# EAGLE design oscillateur (EAGLE 9.3.0)
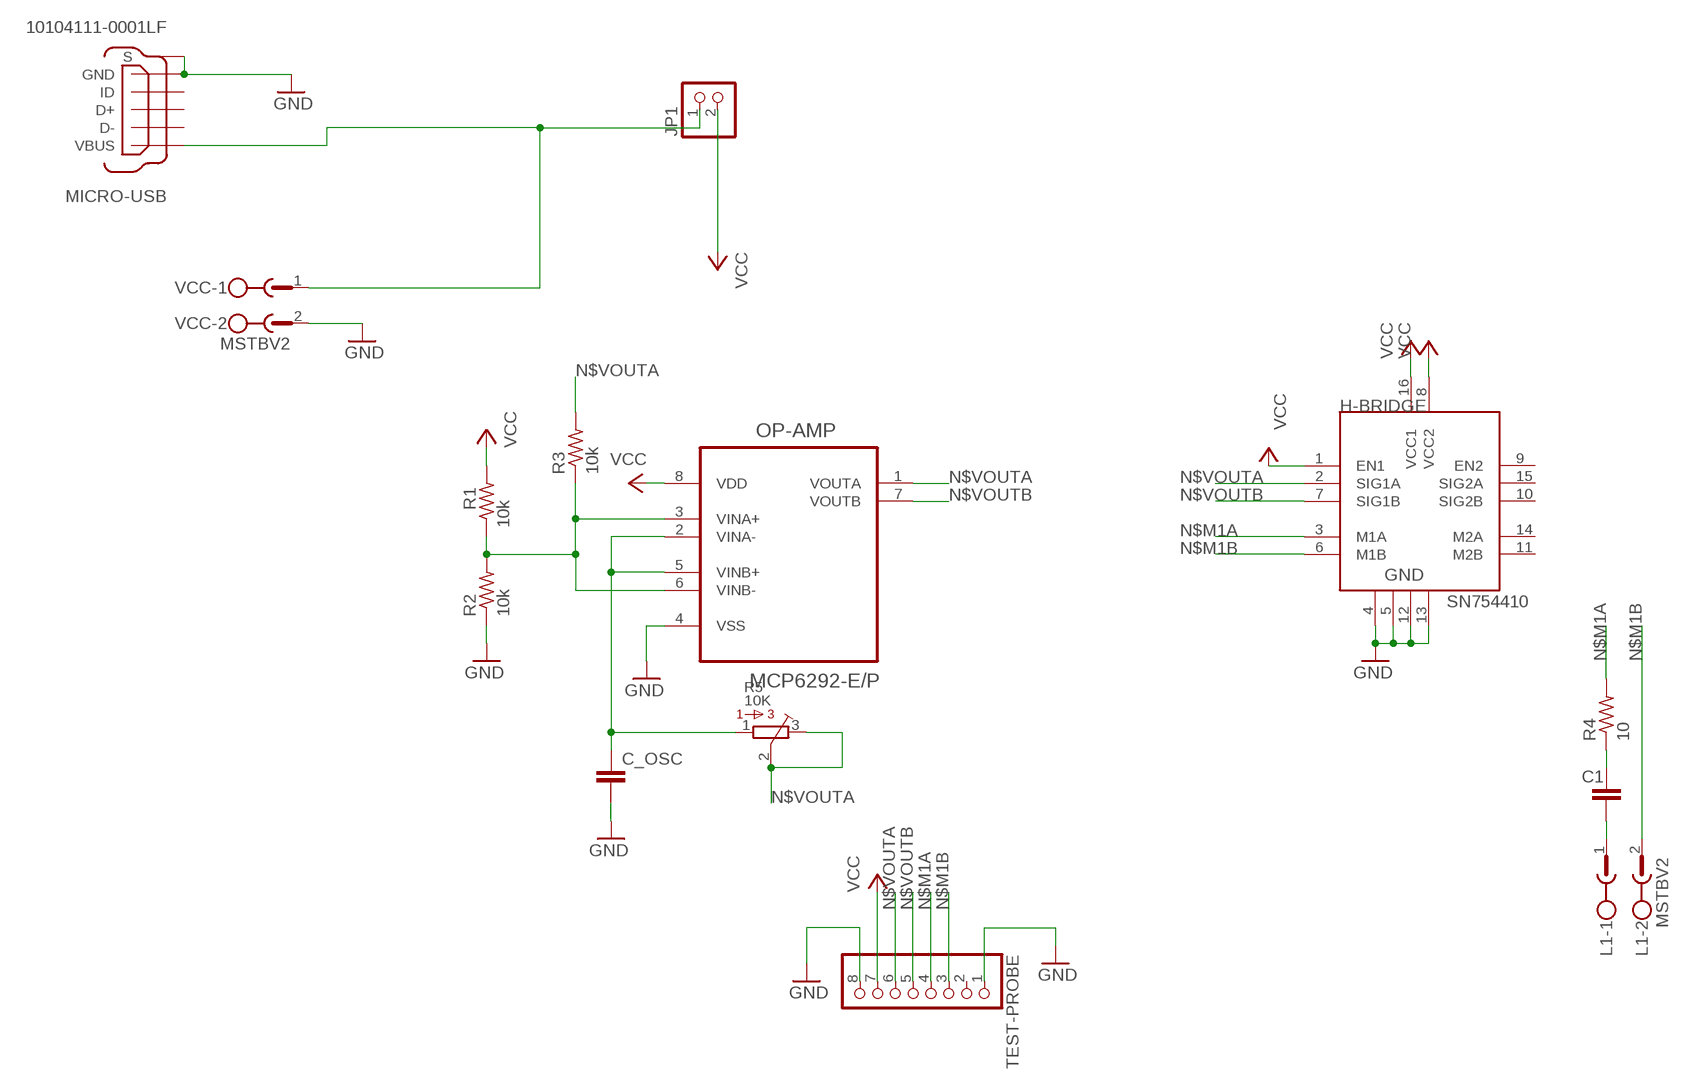
[diagram p0: schematic, sheet 1]

## Parts
C1  C5/2.5  [C5B2.5]
C_OSC  C5/2.5  [C5B2.5]
H-BRIDGE  SN754410  [DIP16]
JP1  PINHD-1X2  [1X02]
L1  MSTBV2  [MSTBV2]
MICRO-USB  10104111-0001LF  [FRAMATOME_10104111-0001LF]
OP-AMP  MCP6292-E/P  [DIP254P762X432-8]
R1  10k  R-US_0207/10  [0207/10]
R2  10k  R-US_0207/10  [0207/10]
R3  10k  R-US_0207/10  [0207/10]
R4  10  R-US_0207/10  [0207/10]
R5  10K  3362R  [3362R]
TEST-PROBE  PINHD-1X8  [1X08]
VCC  MSTBV2  [MSTBV2]

## Nets
GND [supply]: C_OSC.2 H-BRIDGE.4 H-BRIDGE.5 H-BRIDGE.12 H-BRIDGE.13 MICRO-USB.5(GND) MICRO-USB.6(S) MICRO-USB.7(S) MICRO-USB.8(S) MICRO-USB.9(S) OP-AMP.4(VSS) R2.1 TEST-PROBE.1 TEST-PROBE.8 VCC.2
N$1: OP-AMP.3(VINA+) OP-AMP.6(VINB-) R1.1 R2.2 R3.1
N$2 [supply]: JP1.1 MICRO-USB.1(VBUS) VCC.1
N$4 [supply]: C1.1 R4.1
N$6: C_OSC.1 OP-AMP.2(VINA-) OP-AMP.5(VINB+) R5.1
N$7 [supply]: C1.2 L1.1
N$M1A [supply]: H-BRIDGE.3(M1A) R4.2 TEST-PROBE.4
N$M1B [supply]: H-BRIDGE.6(M1B) L1.2 TEST-PROBE.3
N$VOUTA: H-BRIDGE.2(SIG1A) OP-AMP.1(VOUTA) R3.2 R5.2 R5.3 TEST-PROBE.6
N$VOUTB: H-BRIDGE.7(SIG1B) OP-AMP.7(VOUTB) TEST-PROBE.5
VCC [supply]: H-BRIDGE.1(EN1) H-BRIDGE.8(VCC2) H-BRIDGE.16(VCC1) JP1.2 OP-AMP.8(VDD) R1.2 TEST-PROBE.7
Unconnected: H-BRIDGE.9(EN2) H-BRIDGE.10(SIG2B) H-BRIDGE.11(M2B) H-BRIDGE.14(M2A) H-BRIDGE.15(SIG2A) MICRO-USB.2(D-) MICRO-USB.3(D+) MICRO-USB.4(ID) TEST-PROBE.2

## Library data of the parts
C1 C_OSC = capacitor-wima:C: CAPACITOR naming: grid - package width
H-BRIDGE = HBridge:SN754410: Quadruple half-H driver
JP1 = pinhead:PINHD-1X2: PIN HEADER
L1 VCC = con-phoenix-508:MSTBV2: PHOENIX; MPN: MSTBV 2,5/2-GF-5.08; OC_FARNELL: 1792792; OC_NEWARK: 69R9845
MICRO-USB = 10104111-0001LF:10104111-0001LF: Conn USB Type A/B RCP 5 POS 0.65mm Solder RA SMD 5 Terminal 1 Port T/R; AVAILABILITY: Unavailable; DESCRIPTION: Micro Usb, 2.0 Type Ab, Receptacle, Th; MF: Amphenol ICC; MP: 10104111-0001LF; PACKAGE: None; PRICE: None
OP-AMP = MCP6292-E_P:MCP6292-E/P: Rail-to-Rail Op Amp; AVAILABILITY: Unavailable; DESCRIPTION: Operational amplifier; 10MHz; 2.4÷5.5VDC; Channels: 2; DIP8; MF: Microchip; MP: MCP6292-E/P; PACKAGE: DIP-8 Microchip; PRICE: None
R1-R4 = rcl:R-US_: RESISTOR, American symbol; SPICEPREFIX: R
R5 = bourns:3362: 3362 Series 1/4" Square Trimmer
TEST-PROBE = pinhead:PINHD-1X8: PIN HEADER

## Net classes
1 supply: width 0.457 mm

## Board
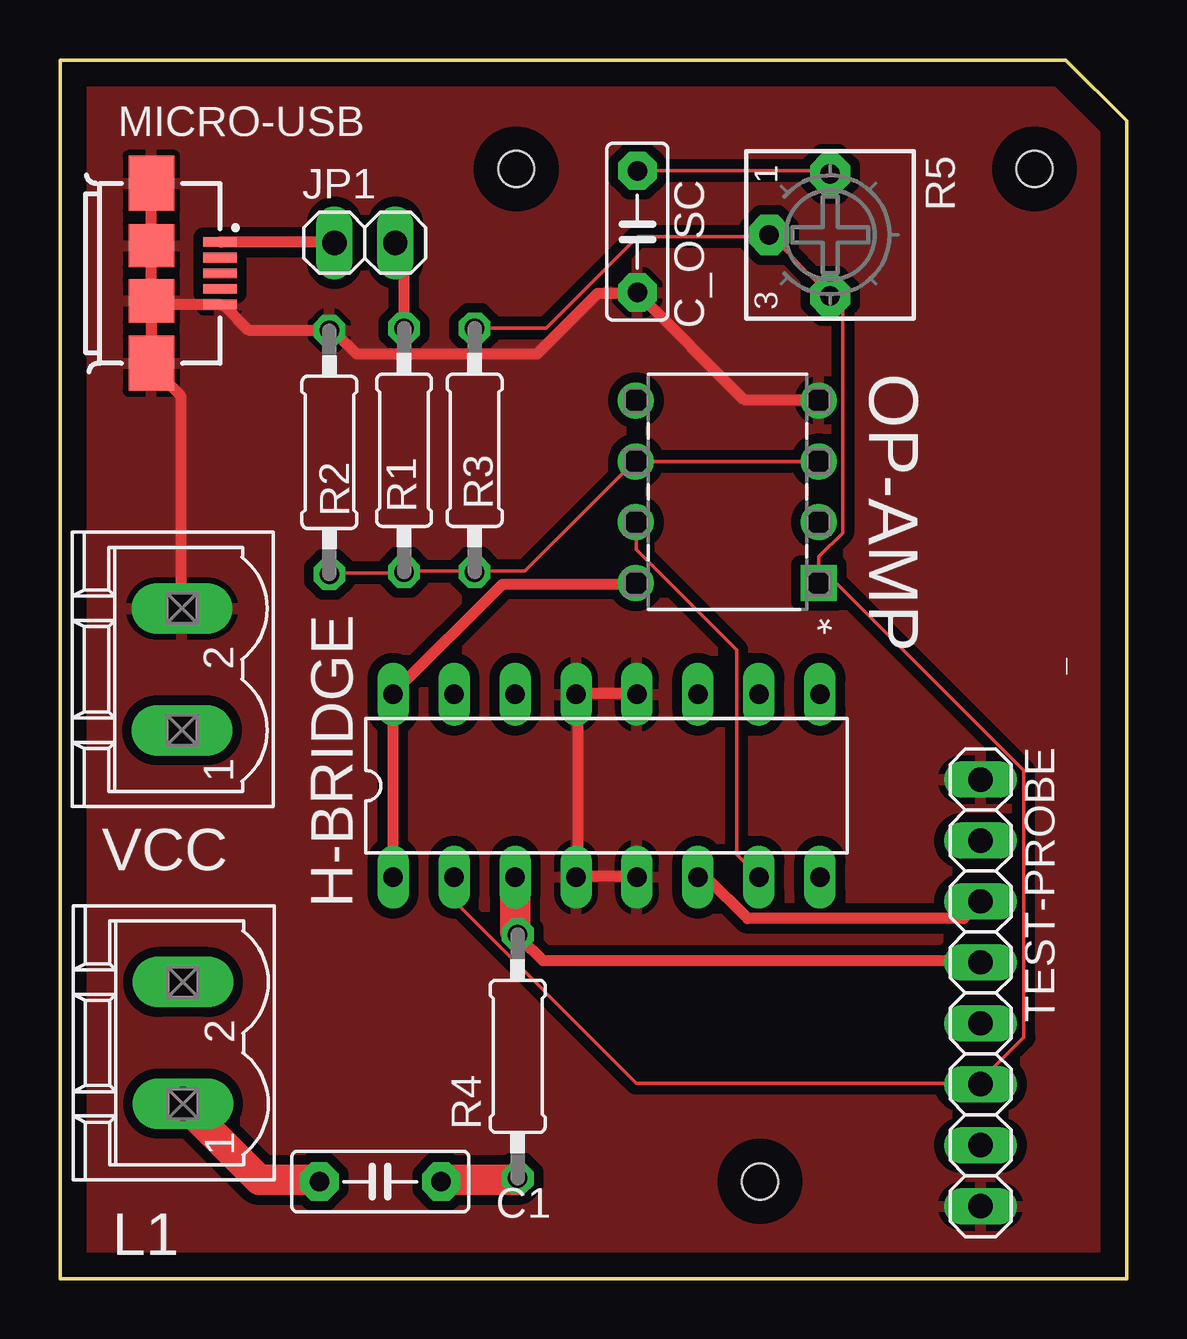
[diagram p1: board, top side]
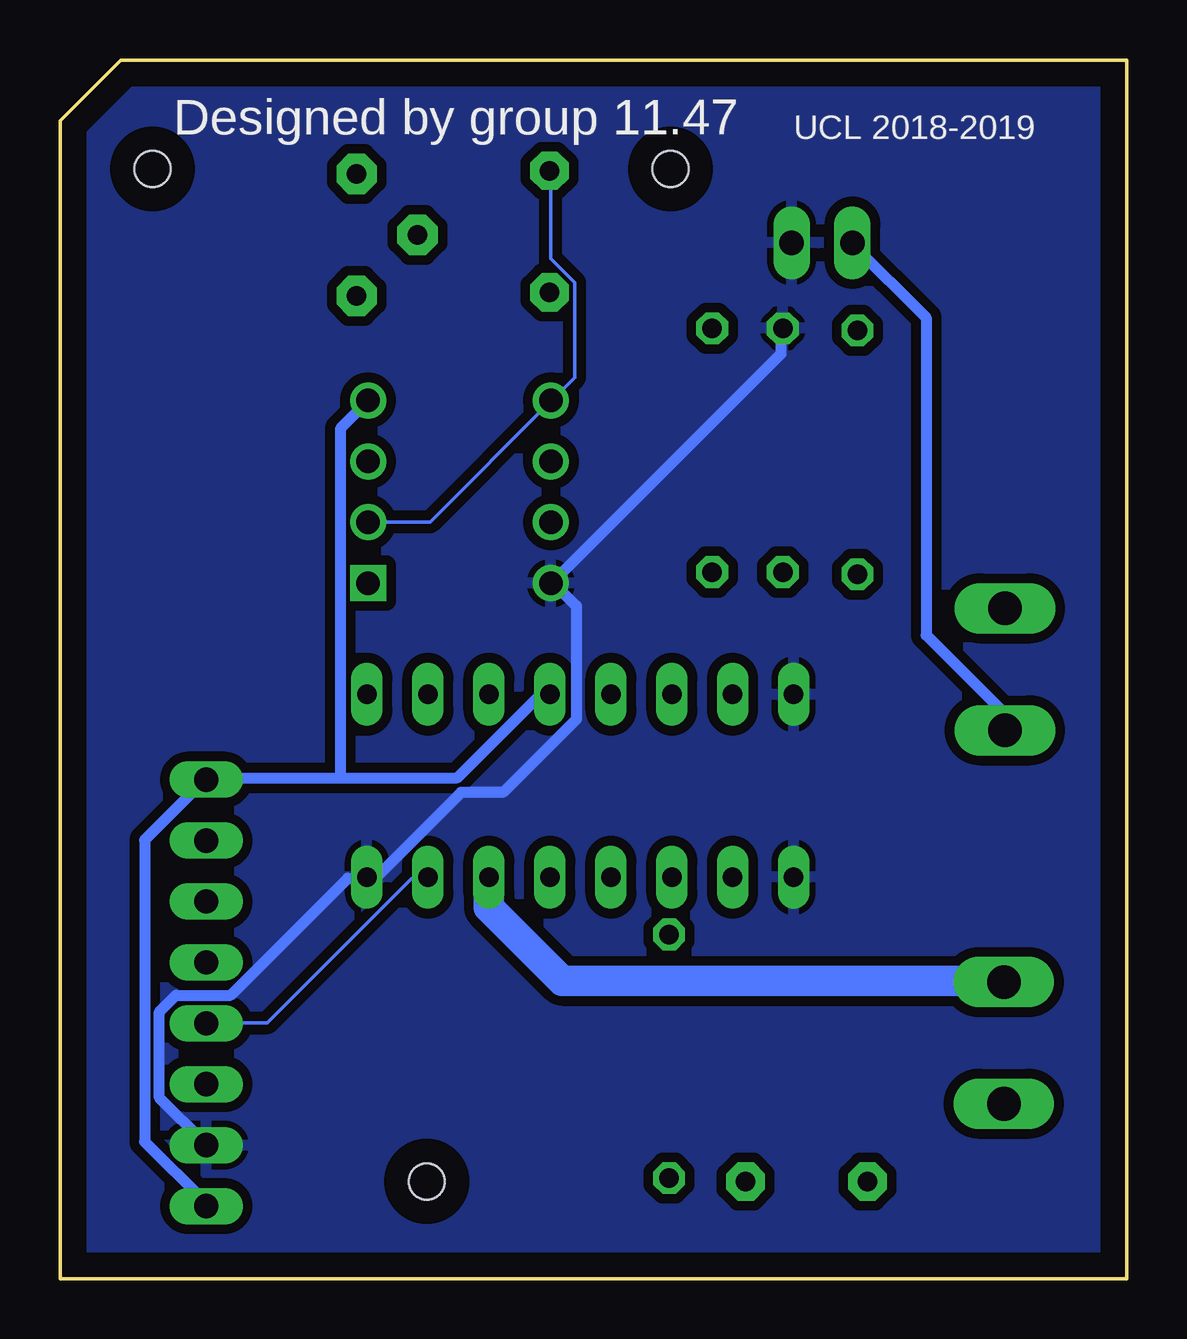
[diagram p2: board, bottom side, seen from below]

Size 44.45 x 50.8 mm. Coordinates in mm from the lower left corner, seen from the top.
Outline: 0,50.8 0,0 44.45,0 44.45,48.26 41.91,50.8 0,50.8
Copper layers (1*16): Top 0.035mm / dielectric 1.5mm / Bottom 0.035mm
Design rules "default": minimum track width 6mil, minimum drill 0.35mm, track to track 6mil, track to pad 6mil, pad to pad 6mil, via to via 6mil, smd to smd 6mil, copper to edge 40mil, drill to drill 6mil, minimum pad ring 10mil, minimum via ring 8mil, stop-mask expansion 4mil, vias tented up to drill 0mil, thermal gap 10mil
Holes 1.5 mm at 19.01,46.26 29.17,4.05 40.6,46.26

### Footprints (pad centres in the part's own frame; a part is rotated, then mirrored left to right if it is on the bottom)
C5B2.5 = drill 0.813 pad 1.6 octagon: 1 -2.54,0; 2 2.54,0
DIP16 = drill 0.813 long: 1 -10.16,-3.81; 2 -7.62,-3.81; 3 -5.08,-3.81; 4 -2.54,-3.81; 5 0,-3.81; 6 2.54,-3.81; 7 5.08,-3.81; 8 7.62,-3.81; 9 7.62,3.81; 10 5.08,3.81; 11 2.54,3.81; 12 0,3.81; 13 -2.54,3.81; 14 -5.08,3.81; 15 -7.62,3.81; 16 -10.16,3.81
1X02 = drill 1.016 long: 1 -1.27,0; 2 1.27,0
MSTBV2 = drill 1.397 long: 1 -2.54,0; 2 2.54,0
FRAMATOME_10104111-0001LF = smd 0.4 x 1.4: 1 -1.3,2.85; 2 -0.65,2.85; 3 0,2.85; 4 0.65,2.85; 5 1.3,2.85 | smd 2.3 x 1.9: 6 -3.75,0; 9 3.75,0 | smd 1.8 x 1.9: 7 -1.15,0; 8 1.15,0
DIP254P762X432-8 = drill 0.991 square: 1 -7.62,7.62 | drill 0.991: 2 -7.62,5.08; 3 -7.62,2.54; 4 -7.62,0; 5 0,0; 6 0,2.54; 7 0,5.08; 8 0,7.62
0207/10 = drill 0.813 octagon: 1 -5.08,0; 2 5.08,0
3362R = drill 0.813 pad 1.676 octagon: 1 -2.54,0; 2 0,-2.54; 3 2.54,0
1X08 = drill 1.016 long: 1 -8.89,0; 2 -6.35,0; 3 -3.81,0; 4 -1.27,0; 5 1.27,0; 6 3.81,0; 7 6.35,0; 8 8.89,0

### Placement (x,y rotation side)
C1  13.35,4.05 180 top
C_OSC  24.05,43.65 270 top
H-BRIDGE  24.04,20.55 0 top
JP1  12.7,43.18 0 top
L1  5.12,9.83 90 top
MICRO-USB  3.81,41.91 270 top
OP-AMP  24,36.61 180 top
R1  14.34,34.53 90 top
R2  11.22,34.45 270 top
R3  17.27,34.53 90 top
R4  19.07,9.27 90 top
R5  32.09,43.51 270 top
TEST-PROBE  38.35,11.91 270 top
VCC  5.08,25.4 90 top

### Tracks (layer width: path | path; a pad name or v marks a point on that pad's centre or on a via)
GND
  Top 0.457: H-BRIDGE.5 24,16.76 21.57,16.76 H-BRIDGE.4 21.57,16.99 21.57,24.16 H-BRIDGE.13 21.57,24.38 24,24.38 H-BRIDGE.12 | OP-AMP.4 31.55,36.65 28.5,36.65 24.08,41.07 C_OSC.2 23.85,41.07 22.4,41.07 19.89,38.56 12.34,38.56 11.43,39.47 R2.1 11.2,39.55 7.85,39.55 6.86,40.54 MICRO-USB.5 6.63,40.62 3.89,40.62 3.81,40.69 MICRO-USB.8 | MICRO-USB.8 MICRO-USB.7 MICRO-USB.6 | MICRO-USB.8 MICRO-USB.9 3.89,37.95 5.03,36.8 5.03,27.96 VCC.2
  Bottom 0.457: TEST-PROBE.8 38.41,3.05 38.41,3.2 40.92,5.71 40.92,18.29 38.41,20.8 TEST-PROBE.1 38.18,20.88 32.77,20.88 | 32.77,20.88 27.89,20.88 24.46,24.31 24.08,24.31 H-BRIDGE.12 | 32.77,20.88 32.77,35.43 31.62,36.58 OP-AMP.4
  pour Top (isolate 0.406): 0,0 0,50.8 41.91,50.8 44.45,48.26 44.45,0
N$1
  Top 0.152: R2.2 11.28,29.41 14.33,29.41 R1.1 14.4,29.49 17.22,29.49 R3.1 17.3,29.49 19.36,29.49 23.93,34.06 OP-AMP.6 31.55,34.06 OP-AMP.3
N$2
  Top 0.457: MICRO-USB.1 6.71,43.2 11.43,43.2 JP1.1
  Bottom 0.457: VCC.1 5.11,22.86 5.11,23.57 8.37,26.83 8.37,40.06 11.43,43.13 JP1.1
N$4
  Top 0.457: 19.05,4.12 R4.1 | 15.93,4.12 C1.1
  Top 1.27: 15.93,4.12 19.05,4.12
N$6
  Top 0.152: C_OSC.1 24.08,46.18 32,46.18 32.08,46.1 R5.1
  Bottom 0.152: OP-AMP.2 31.55,31.55 29.03,31.55 24,36.58 OP-AMP.5 23.93,36.65 23.01,37.57 23.01,41.53 24,42.52 24,46.18 C_OSC.1
N$7
  Top 0.457: 10.74,4.12 C1.2 | 5.18,7.24 L1.1
  Top 1.27: 10.74,4.12 8.31,4.12 5.18,7.24
N$M1A
  Top 0.457: 18.97,14.48 19.05,14.4 R4.2 19.2,14.17 20.12,13.26 38.33,13.26 TEST-PROBE.4 | 18.97,16.69 H-BRIDGE.3
  Top 1.27: 18.97,14.48 18.97,16.69
N$M1B
  Top 0.457: H-BRIDGE.6 26.59,16.69 26.98,16.69 28.65,15.01 37.64,15.01 38.33,15.7 TEST-PROBE.3
  Bottom 0.457: 5.18,12.42 L1.2
  Bottom 1.27: 5.18,12.42 23.52,12.42 26.58,15.48 H-BRIDGE.6
N$VOUTA
  Top 0.152: R3.2 17.3,39.62 20.27,39.62 24.08,43.43 29.49,43.43 R5.2 29.57,43.51 32.08,41 R5.3 32.16,40.92 32.61,40.46 32.61,31.09 31.62,30.1 31.62,29.03 OP-AMP.1 31.7,29.03 32.31,29.03 40.16,21.18 40.16,10.06 38.33,8.23 TEST-PROBE.6 38.33,8.15 24,8.15 16.46,15.7 16.46,16.69 H-BRIDGE.2
N$VOUTB
  Top 0.152: OP-AMP.7 24,31.47 24,30.4 28.19,26.21 28.19,17.68 29.11,16.76 H-BRIDGE.7
  Bottom 0.152: H-BRIDGE.7 29.18,16.69 29.79,16.69 35.81,10.67 38.33,10.67 TEST-PROBE.5
VCC
  Top 0.457: JP1.2 14.33,42.82 14.33,39.62 R1.2 | H-BRIDGE.1 13.87,16.76 13.87,24.31 H-BRIDGE.16 14.02,24.54 18.44,28.96 23.93,28.96 OP-AMP.8
  Bottom 0.457: TEST-PROBE.7 38.41,5.64 40.31,7.54 40.31,11.12 39.62,11.81 37.34,11.81 32.46,16.69 31.7,16.69 H-BRIDGE.8 31.47,16.84 31.17,16.84 27.74,20.27 25.98,20.27 22.94,23.32 22.94,28.04 23.77,28.88 OP-AMP.8 23.93,29.03 14.4,38.56 14.4,39.55 R1.2
  pour Bottom (isolate 0.406): 0,0 0,50.8 41.91,50.8 44.45,48.26 44.45,0

### Text on the board
bNames: Designed by group 11.47 | UCL 2018-2019
207bmp: C:/Users/moi/Pictures/helli.bmp